# Altium schematic sheet ECAT1_(OUT).SchDoc
size A3; SheetNumber: 4; SheetTotal: 7
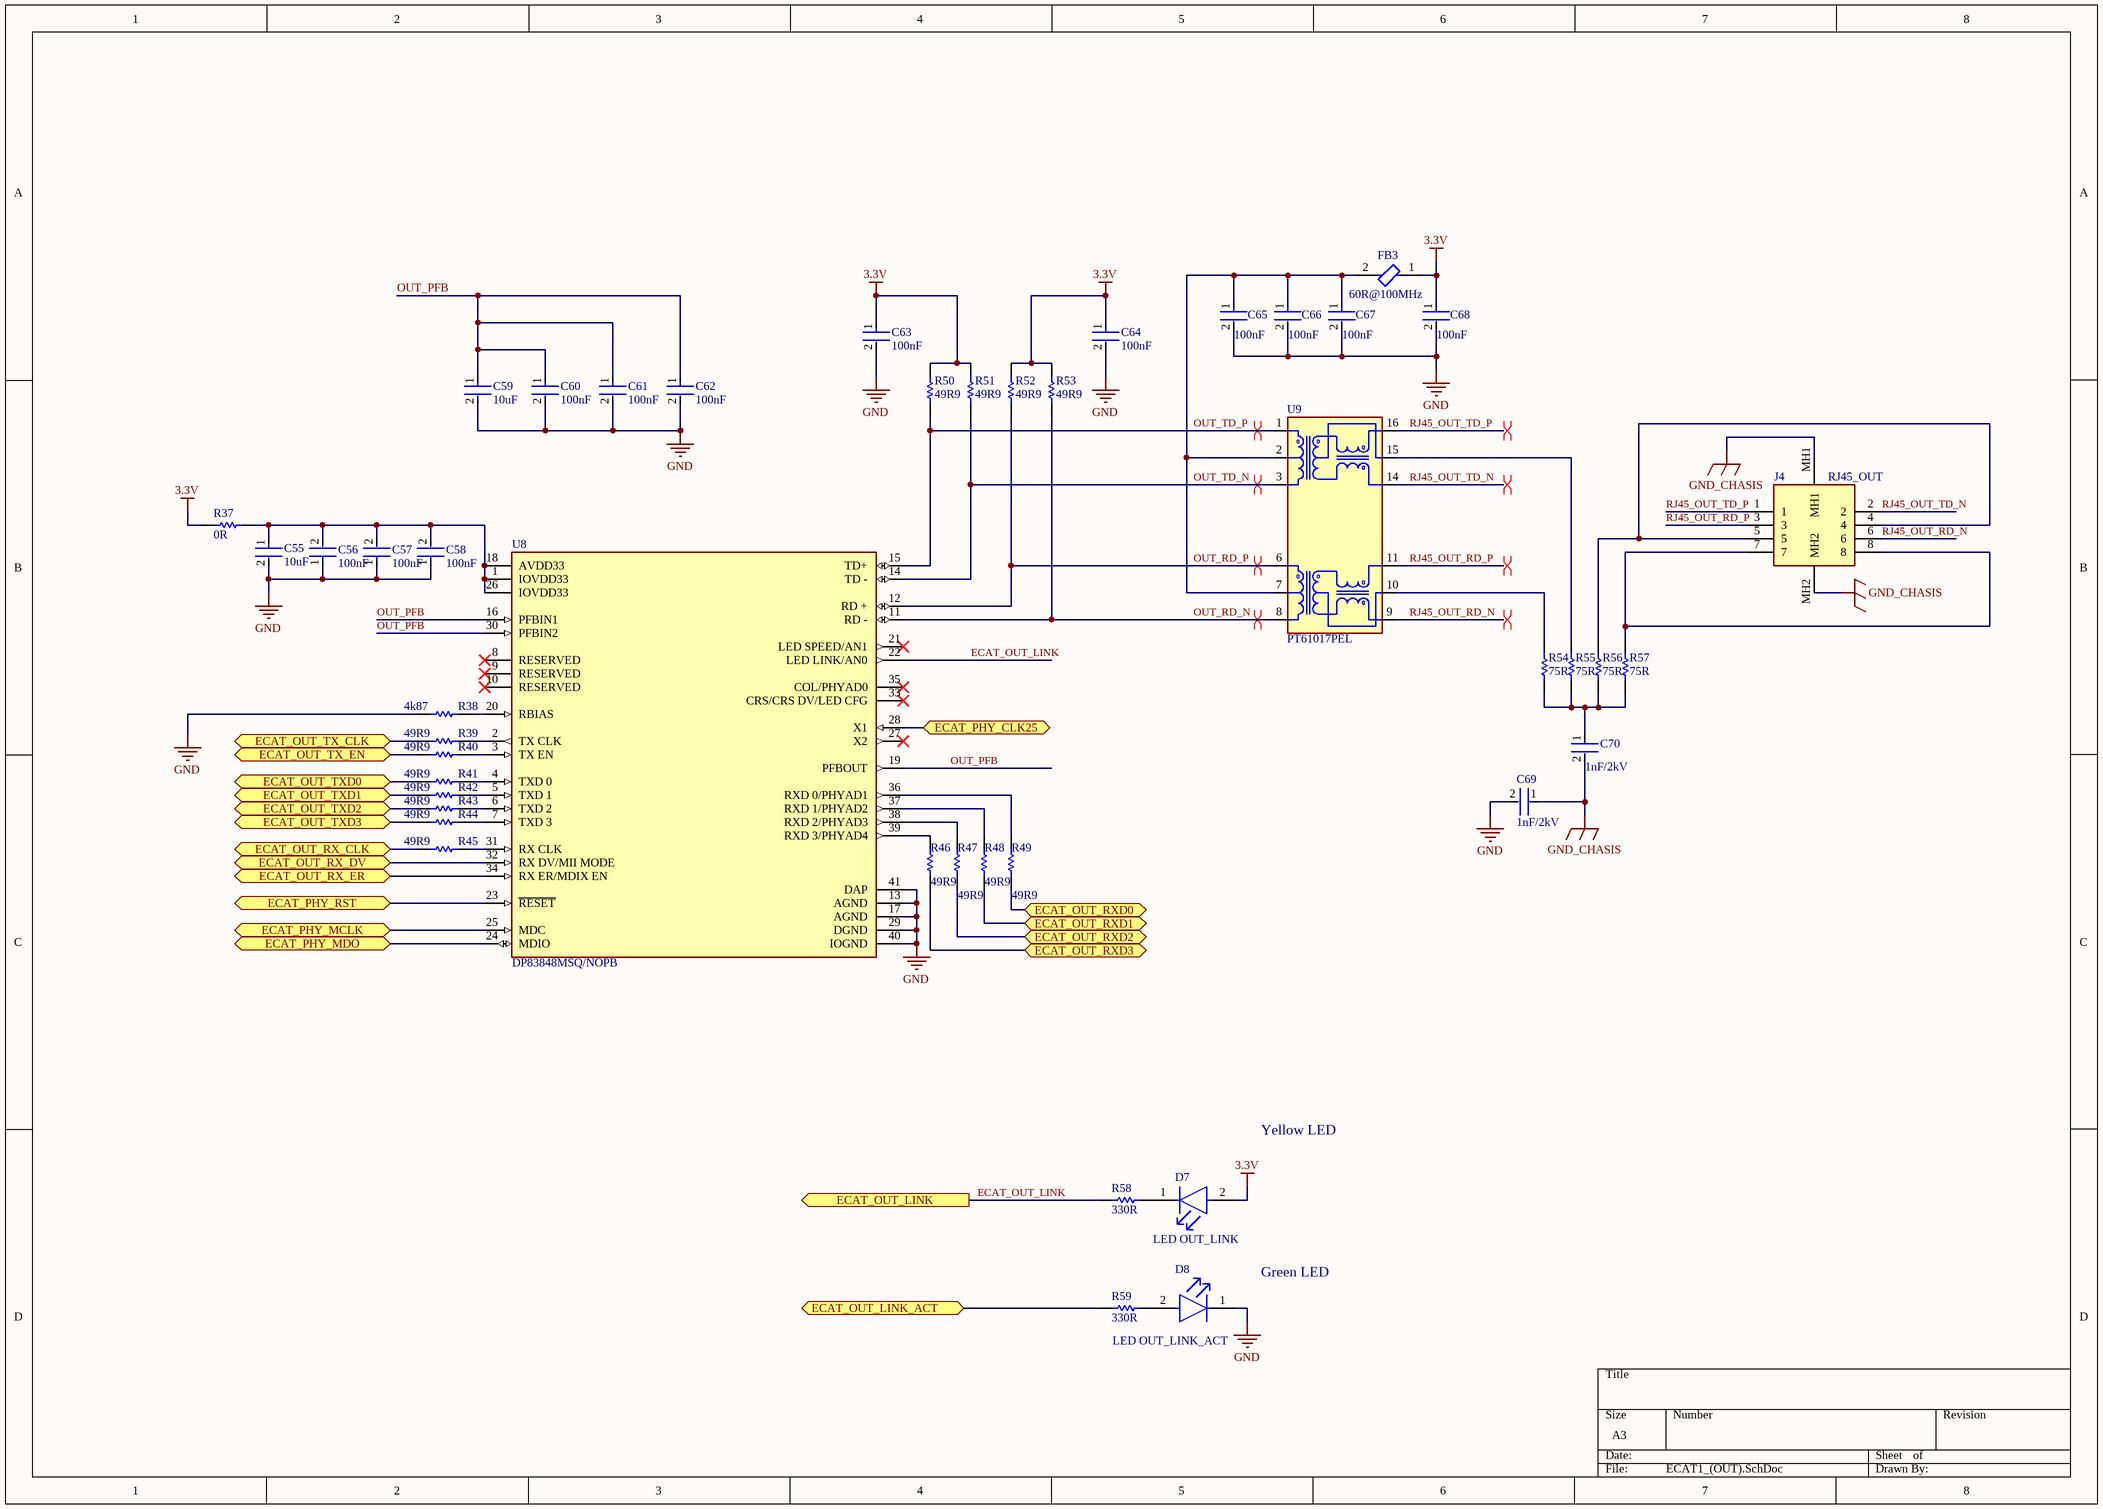
[diagram p0: ECAT1_(OUT).SchDoc]

## Parts
C55  10uF  [FP-C0805C-DN-MFG]
C56  100nF  [FP-C0805C-DN-MFG]
C57  100nF  [FP-C0805C-DN-MFG]
C58  100nF  [FP-C0805C-DN-MFG]
C59  10uF  [FP-C0805C-DN-MFG]
C60  100nF  [FP-C0805C-DN-MFG]
C61  100nF  [FP-C0805C-DN-MFG]
C62  100nF  [FP-C0805C-DN-MFG]
C63  100nF  [FP-C0805C-DN-MFG]
C64  100nF  [FP-C0805C-DN-MFG]
C65  100nF  [FP-C0805C-DN-MFG]
C66  100nF  [FP-C0805C-DN-MFG]
C67  100nF  [FP-C0805C-DN-MFG]
C68  100nF  [FP-C0805C-DN-MFG]
C69  1nF/2kV  [FP-CC1206-0_3-1_45-IPC_C]
C70  1nF/2kV  [FP-CC1206-0_3-1_45-IPC_C]
D7  LED OUT_LINK  [FP-LTST-C191GKT-MFG]
D8  LED OUT_LINK_ACT  [FP-LTST-C191GKT-MFG]
FB3  60R@100MHz  [FP-BLM18-0_15-t0_8-IPC_B]
J4  RJ45_OUT  [438600010]
R37  0R  [RESC1609X50X30NL8T20]
R38  4k87  [RESC2013X50X30LL20T20]
R39  49R9  [RESC2013X50X30LL20T20]
R40  49R9  [RESC2013X50X30LL20T20]
R41  49R9  [RESC2013X50X30LL20T20]
R42  49R9  [RESC2013X50X30LL20T20]
R43  49R9  [RESC2013X50X30LL20T20]
R44  49R9  [RESC2013X50X30LL20T20]
R45  49R9  [RESC2013X50X30LL20T20]
R46  49R9  [RESC2013X50X30LL20T20]
R47  49R9  [RESC2013X50X30LL20T20]
R48  49R9  [RESC2013X50X30LL20T20]
R49  49R9  [RESC2013X50X30LL20T20]
R50  49R9  [RESC2013X50X30LL20T20]
R51  49R9  [RESC2013X50X30LL20T20]
R52  49R9  [RESC2013X50X30LL20T20]
R53  49R9  [RESC2013X50X30LL20T20]
R54  75R  [RESC2013X50X30LL20T20]
R55  75R  [RESC2013X50X30LL20T20]
R56  75R  [RESC2013X50X30LL20T20]
R57  75R  [RESC2013X50X30LL20T20]
R58  330R  [RESC2013X50X30LL20T20]
R59  330R  [RESC2013X50X30LL20T20]
U8  DP83848MSQ/NOPB  [FP-RTA0040A-IPC_B]
U9  PT61017PEL  [PT61017PEL]

## Ports
ECAT_OUT_LINK (out, see MCU[7B]), ECAT_OUT_LINK_ACT (bidir, see MCU[5B]), ECAT_OUT_RX_CLK (bidir, see MCU[5B]), ECAT_OUT_RX_DV (bidir, see MCU[5C]), ECAT_OUT_RX_ER (bidir, see MCU[7B]), ECAT_OUT_RXD0 (bidir, see MCU[7B]), ECAT_OUT_RXD1 (bidir, see MCU[5B]), ECAT_OUT_RXD2 (bidir, see MCU[5B]), ECAT_OUT_RXD3 (bidir, see MCU[5B]), ECAT_OUT_TX_CLK (bidir, see MCU[5B]), ECAT_OUT_TX_EN (bidir, see MCU[5A]), ECAT_OUT_TXD0 (bidir, see MCU[5A]), ECAT_OUT_TXD1 (bidir, see MCU[5B]), ECAT_OUT_TXD2 (bidir, see MCU[5B]), ECAT_OUT_TXD3 (bidir, see MCU[5B]), ECAT_PHY_CLK25 (bidir, see ECAT0_(IN)[4B], MCU[6D]), ECAT_PHY_MCLK (bidir, see ECAT0_(IN)[1C], MCU[5B]), ECAT_PHY_MDO (bidir, see ECAT0_(IN)[1C], MCU[5B]), ECAT_PHY_RST (bidir, see ECAT0_(IN)[1C], MCU[6C])

## Nets
3.3V: C63.1 C64.1 C68.1 D7.2(A) FB3.1 R37.2 R50.2 R51.2 R52.2 R53.2
GND: C55.2 C56.1 C57.1 C58.1 C59.2 C60.2 C61.2 C62.2 C63.2 C64.2 C65.2 C66.2 C67.2 C68.2 C69.2 D8.1(C) R38.1 U8.13(AGND) U8.17(AGND) U8.29(DGND) U8.40(IOGND) U8.41(DAP)
GND_CHASIS: C69.1 C70.2 J4.MH1 J4.MH2
ECAT_OUT_LINK: R58.1 U8.22(LED_LINK/AN0) ; port ECAT_OUT_LINK
ECAT_OUT_LINK_ACT: R59.1 ; port ECAT_OUT_LINK_ACT
ECAT_OUT_RX_CLK: R45.1 ; port ECAT_OUT_RX_CLK
ECAT_OUT_RX_DV: U8.32(RX_DV/MII_MODE) ; port ECAT_OUT_RX_DV
ECAT_OUT_RX_ER: U8.34(RX_ER/MDIX_EN) ; port ECAT_OUT_RX_ER
ECAT_OUT_RXD0: R49.1 ; port ECAT_OUT_RXD0
ECAT_OUT_RXD1: R48.1 ; port ECAT_OUT_RXD1
ECAT_OUT_RXD2: R47.1 ; port ECAT_OUT_RXD2
ECAT_OUT_RXD3: R46.1 ; port ECAT_OUT_RXD3
ECAT_OUT_TX_CLK: R39.1 ; port ECAT_OUT_TX_CLK
ECAT_OUT_TX_EN: R40.1 ; port ECAT_OUT_TX_EN
ECAT_OUT_TXD0: R41.1 ; port ECAT_OUT_TXD0
ECAT_OUT_TXD1: R42.1 ; port ECAT_OUT_TXD1
ECAT_OUT_TXD2: R43.1 ; port ECAT_OUT_TXD2
ECAT_OUT_TXD3: R44.1 ; port ECAT_OUT_TXD3
ECAT_PHY_CLK25: U8.28(X1) ; port ECAT_PHY_CLK25
ECAT_PHY_MCLK: U8.25(MDC) ; port ECAT_PHY_MCLK
ECAT_PHY_MDO: U8.24(MDIO) ; port ECAT_PHY_MDO
ECAT_PHY_RST: U8.23(~{RESET}) ; port ECAT_PHY_RST
OUT_PFB: C59.1 C60.1 C61.1 C62.1 U8.16(PFBIN1) U8.19(PFBOUT) U8.30(PFBIN2)
OUT_RD_N: R53.1 U8.11(RD_-) U9.8
OUT_RD_P: R52.1 U8.12(RD_+) U9.6
OUT_TD_N: R51.1 U8.14(TD_-) U9.3
OUT_TD_P: R50.1 U8.15(TD+) U9.1
RJ45_OUT_RD_N: J4.6 U9.9
RJ45_OUT_RD_P: J4.3 U9.11
RJ45_OUT_TD_N: J4.2 U9.14
RJ45_OUT_TD_P: J4.1 U9.16
NetC55_1: C55.1 C56.2 C57.2 C58.2 R37.1 U8.1(IOVDD33) U8.18(AVDD33) U8.26(IOVDD33)
NetC65_1: C65.1 C66.1 C67.1 FB3.2 U9.2 U9.7
NetC70_1: C70.1 R54.1 R55.1 R56.1 R57.1
NetD7_1: D7.1(C) R58.2
NetD8_2: D8.2(A) R59.2
NetJ4_4: J4.4 J4.5 R56.2
NetJ4_7: J4.7 J4.8 R57.2
NetR38_2: R38.2 U8.20(RBIAS)
NetR39_2: R39.2 U8.2(TX_CLK)
NetR40_2: R40.2 U8.3(TX_EN)
NetR41_2: R41.2 U8.4(TXD_0)
NetR42_2: R42.2 U8.5(TXD_1)
NetR43_2: R43.2 U8.6(TXD_2)
NetR44_2: R44.2 U8.7(TXD_3)
NetR45_2: R45.2 U8.31(RX_CLK)
NetR46_2: R46.2 U8.39(RXD_3/PHYAD4)
NetR47_2: R47.2 U8.38(RXD_2/PHYAD3)
NetR48_2: R48.2 U8.37(RXD_1/PHYAD2)
NetR49_2: R49.2 U8.36(RXD_0/PHYAD1)
NetR54_2: R54.2 U9.10
NetR55_2: R55.2 U9.15

Not connected (* = marked no-connect by the designer): U8 8(RESERVED)* 9(RESERVED)* 10(RESERVED)* 21(LED_SPEED/AN1)* 27(X2)* 33(CRS/CRS_DV/LED_CFG)* 35(COL/PHYAD0)*

## Layout directives
differential pair; differential pair class OUT_TD: OUT_TD_N, OUT_TD_P
differential pair; differential pair class OUT_RD: OUT_RD_N, OUT_RD_P
differential pair; differential pair class RJ45_OUT_TD: RJ45_OUT_TD_N, RJ45_OUT_TD_P
differential pair; differential pair class RJ45_OUT_RD: RJ45_OUT_RD_N, RJ45_OUT_RD_P

## Notes on the sheet
- Yellow LED
- Green LED

## Library data of the parts
C55-C68 = CMP-2007-00279-2: CAP CER 0.1UF 50V X7R 0805; Manufacturer Part Number: C0805C104K5RACTU; Manufacturer: KEMET; Value: 0.10 μF; Tolerance: 0.1; Temperature Coefficient: 30ppm/°C; Material: Ceramic; Device Class L2: Capacitors; Temperature Range Low: -55°C; Voltage Rating: 50 V; Digikey Description: CAP CER 0.1UF 50V X7R 0805; Category: Cap; ComponentLink2Description: Datasheet; Octopart: https://octopart.com/c0805c104k5ractu-kemet-143926; RoHS: TRUE; ComponentLink2URL: https://content.kemet.com/datasheets/KEM_C1003_C0G_SMD.pdf; Temperature Characteristic: X7R; Temperature: -55°C to +125°C; Height: 0.88mm; Temperature Range High: +125°C; Device Class L1: Passive Components; Automotive: No; Lead Free: Yes; Ipc Land Pattern Name: CAPC200125X78; Device Class L3: Ceramic Capacitors; Mouser Description: Cap Ceramic 0.1uF 50V X7R 10% SMD 2.0 x 1.2 mm 125 C Paper T/R; Capacitance: 0.10 μF; Package: C0805C-DN
C69 C70 = CMP-2000-05436-2: 1nF/2kV/1206; Voltage Rating (DC): 2kV; Capacitance: 1nF; Dielectric: X7R; Insulation Resistance: 10GR; Dissipation Factor: 2.5%; Tolerance: 10%; Termination: SMD/SMT; Case/Package: 1206; Length: 3.2mm; Depth: 1.6mm; Case Code (Imperial): 1206; Package Quantity: 1; Packaging: Tape and Reel; Mount: Surface Mount; Max Operating Temperature: 125°C; Lead Free: Lead Free; Number of Pins: 2; Thickness: 0.057inch; Width: 0.063inch; Resistor Type: Ceramic; Series: CC; RoHS Compliant: Yes; Voltage Rating: 2kV; Radiation Hardening: No; Construction: Flat; Height: 1.25mm; Min Operating Temperature: -55°C; Voltage: 2kV; Case Code (Metric): 3216
D7 = CMP-22017-000029-1: KPHD-1608LVSYCK; Power Dissipation: 100mW; Lens Color: Colorless; Number of Elements: 1; Dominant Wavelength: 569nm; Illumination Color: Green; Lens Style: Clear; Forward Voltage: 2.1V; Forward Current: 30mA; Test Current: 20mA; Viewing Angle: 130°; Wavelength: 565nm; Luminous Intensity: 12mcd; Reverse Voltage: 5V; Case/Package: 0603; Package Quantity: 1; Lens Transparency: Clear; Depth: 0.8mm; Power Rating: 100mW; Width: 0.8mm; Height: 0.55mm; Radiation Hardening: No; Case Code (Imperial): 0603; Number of Pins: 2; Length: 1.6mm; Case Code (Metric): 1608; Max Operating Temperature: 85°C; Color: Green; Packaging: Tape and Reel; Mount: Surface Mount; Min Operating Temperature: -55°C; Lead Free: Lead Free; Number of LEDs: 1
D8 = CMP-22017-000029-1: KPHD-1608LVCGCK; Power Dissipation: 100mW; Lens Color: Colorless; Number of Elements: 1; Dominant Wavelength: 569nm; Illumination Color: Green; Lens Style: Clear; Forward Voltage: 2.1V; Forward Current: 30mA; Test Current: 20mA; Viewing Angle: 130°; Wavelength: 565nm; Luminous Intensity: 12mcd; Reverse Voltage: 5V; Case/Package: 0603; Package Quantity: 1; Lens Transparency: Clear; Depth: 0.8mm; Power Rating: 100mW; Width: 0.8mm; Height: 0.55mm; Radiation Hardening: No; Case Code (Imperial): 0603; Number of Pins: 2; Length: 1.6mm; Case Code (Metric): 1608; Max Operating Temperature: 85°C; Color: Green; Packaging: Tape and Reel; Mount: Surface Mount; Min Operating Temperature: -55°C; Lead Free: Lead Free; Number of LEDs: 1
FB3 = CMP-0686-00575-3: Chip Ferrite Bead, 0603, 60Ω @ 100MHz, 0.1Ω, , 1A; ESR (Equivalent Series Resistance): 60R; Number of Lines: 1; Material: Steel; Tolerance: 25%; Shielding: Unshielded; Current Rating: 500mA; Resistance: 100mR; Package Quantity: 1; Termination: SMD/SMT; Lead Free: Lead Free; Max Operating Temperature: 125°C; Number of Circuits: 1; Length: 1.6mm; Min Operating Temperature: -55°C; Case Code (Metric): 1608; Max DC Current: 500mA; REACH SVHC: No SVHC; Frequency: 100MHz; Number of Pins: 2; RoHS Compliant: Yes; Height: 0.8mm; Depth: 0.8mm; Width: 0.8mm; Test Frequency: 100MHz; Case/Package: 0603; Impedance: 60R; Max Current Rating: 500mA; Packaging: Tape and Reel; DC Resistance (DCR): 100mR; Case Code (Imperial): 0603; Core Material: Ferrite
J4 = 43860-0010: Modular Jack Right Angle 8/8 RJ45 Invert Molex Cat3 RJ45 Modular Jack Socket, Right Angle, Through Hole 43860 / 43860-0010; Geometry.Height: 13.79mm; Mouser Part Number: 538-43860-0010; Mouser Price/Stock: https://www.mouser.co.uk/ProductDetail/Molex/43860-0010?qs=qjii0NTOo%252B4EzowI%2FkFJuQ%3D%3D; Manufacturer_Name: Molex; Manufacturer_Part_Number: 43860-0010; Datasheet Link: https://www.molex.com/webdocs/datasheets/pdf/en-us/0438600010_MODULAR_JACKS_PLUG.pdf
R37 = CMP-2000-03816-5: 0603; Manufacturer: Vishay Semiconductor; Voltage Rating: 75 V; Package Quantity: 5000; DatasheetVersion: 06/2012; Min Operating Temperature: -55 degC; ComponentLink1URL: http://www.vishay.com/; Mounting Technology: Surface Mount; Height: 0.45 mm; ComponentLink1Description: Manufacturer URL; REACH SVHC: Unknown; PackageReference: 0603; Packaging: Tape and Reel; Max Operating Temperature: 155 degC; Mount: Surface Mount; ComponentLink2Description: Datasheet; PackageDescription: 2-Pin Surface Mount Device, Body 1.575 x 0.85 mm; Length: 1.55 mm; ComponentLink2URL: http://www.vishay.com/docs/20035/dcrcwe3.pdf; Pins: 2; RoHSCompliant: true
R38-R59 = CMP-2001-04896-1: 0805; Manufacturer: Vishay Dale; Part Number: CRCW08050000Z0EA
U8 = CMP-0058-00351-5: IC TRANSCEIVER 1/1 40WQFN; Number of Ports: 1; Cable Length: 137m; Data Rate: 100Mbps; Interface: Serial; Max Power Dissipation: 264mW; Nominal Supply Current: 92mA; Operating Supply Voltage: 3.3V; Max Supply Voltage: 3.6V; Min Supply Voltage: 3V; Series: DP83848M; Packaging: Tape and Reel; Number of Transceivers: 1; Max Operating Temperature: 70°C; Number of Channels: 1; Lead Free: Lead Free; Height: 0.8mm; Termination: SMD/SMT; Min Operating Temperature: 0°C; Mount: Surface Mount; Width: 4.6mm; Package Quantity: 250; Radiation Hardening: No; RoHS Compliant: Yes; REACH SVHC: No SVHC; Length: 4.6mm; Number of Pins: 40; Supply Current: 92mA
U9 = PT61017PEL: 350 µH LAN 10/100 Base-T Pulse Transformer 1CT:1CT Surface Mount / PT61017PEL; MF: Bourns; Package: SMD-16 Bourns; Price: None; Availability: In Stock; Purchase-URL: https://pricing.snapeda.com/search/part/PT61017PEL/?ref=eda; Check_prices: https://www.snapeda.com/parts/PT61017PEL/Bourns/view-part/?ref=eda; MP: PT61017PEL; SnapEDA_Link: https://www.snapeda.com/parts/PT61017PEL/Bourns/view-part/?ref=snap; Value: *